# Altium schematic sheet KS-WL-GW-RS485.SchDoc
size A4; CheckedBy: Fan mingjie; DrawnBy: Jason Huang; Address1: Buliding 5, No.1528; Address2: Gu Mei Rd HQ6; Address3: Shanghai, China; Address4: 20233; DocumentNumber: 1; Revision: 1; SheetNumber: 1; SheetTotal: 2
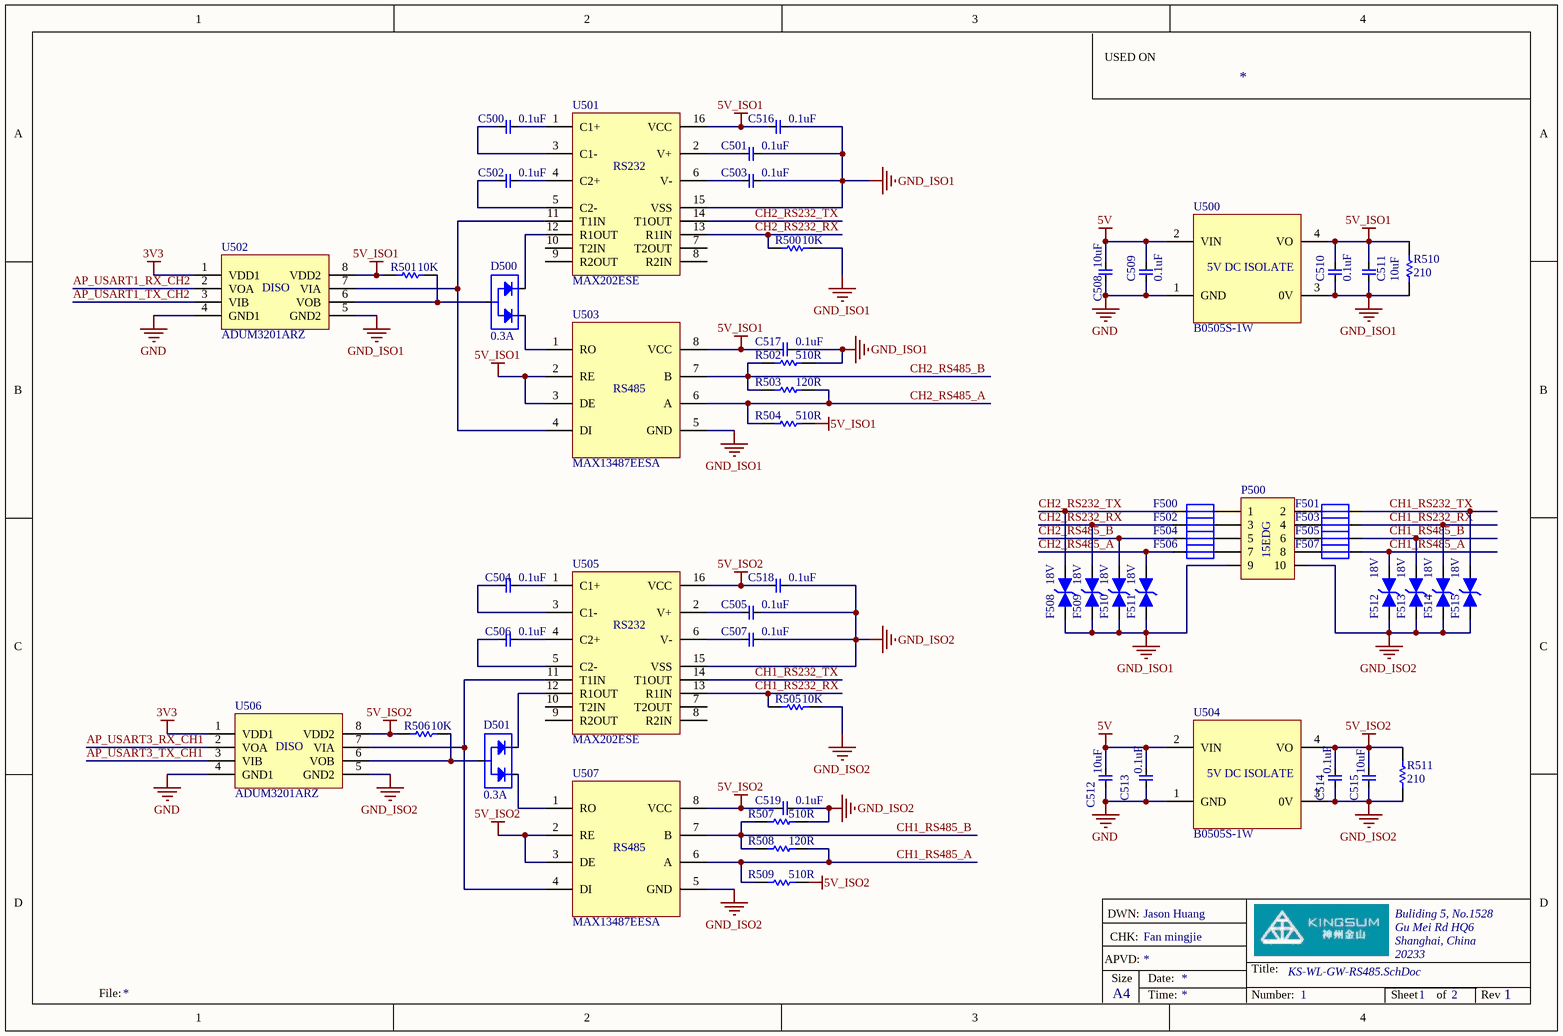
[diagram p0: KS-WL-GW-RS485.SchDoc]

## Parts
C500  0.1uF  [0402 CAP]
C501  0.1uF  [0402 CAP]
C502  0.1uF  [0402 CAP]
C503  0.1uF  [0402 CAP]
C504  0.1uF  [0402 CAP]
C505  0.1uF  [0402 CAP]
C506  0.1uF  [0402 CAP]
C507  0.1uF  [0402 CAP]
C508  10uF  [C1206_L]
C509  0.1uF  [0402 CAP]
C510  0.1uF  [0402 CAP]
C511  10uF  [C1206_L]
C512  10uF  [C1206_L]
C513  0.1uF  [0402 CAP]
C514  0.1uF  [0402 CAP]
C515  10uF  [C1206_L]
C516  0.1uF  [0402 CAP]
C517  0.1uF  [0402 CAP]
C518  0.1uF  [0402 CAP]
C519  0.1uF  [0402 CAP]
D500  0.3A  [SOT-23-3]
D501  0.3A  [SOT-23-3]
F500  1206L025YR  [1206_FUSE]  (value not drawn)
F501  1206L025YR  [1206_FUSE]  (value not drawn)
F502  1206L025YR  [1206_FUSE]  (value not drawn)
F503  1206L025YR  [1206_FUSE]  (value not drawn)
F504  1206L025YR  [1206_FUSE]  (value not drawn)
F505  1206L025YR  [1206_FUSE]  (value not drawn)
F506  1206L025YR  [1206_FUSE]  (value not drawn)
F507  1206L025YR  [1206_FUSE]  (value not drawn)
F508  18V  [LC-SMB(DO-214AA)_S5]
F509  18V  [LC-SMB(DO-214AA)_S5]
F510  18V  [LC-SMB(DO-214AA)_S5]
F511  18V  [LC-SMB(DO-214AA)_S5]
F512  18V  [LC-SMB(DO-214AA)_S5]
F513  18V  [LC-SMB(DO-214AA)_S5]
F514  18V  [LC-SMB(DO-214AA)_S5]
F515  18V  [LC-SMB(DO-214AA)_S5]
P500  Kingsum-CONN-15EDG 5X2  [15EDG-5x2 LOCK]  (value not drawn)
R500  10K  [0402 Res]
R501  10K  [0402 Res]
R502  510R  [0402 Res]
R503  120R  [0402 Res]
R504  510R  [0402 Res]
R505  10K  [0402 Res]
R506  10K  [0402 Res]
R507  510R  [0402 Res]
R508  120R  [0402 Res]
R509  510R  [0402 Res]
R510  210  [0805 Res]
R511  210  [0805 Res]
U500  B0505S-1W  [B0505S]
U501  MAX202ESE  [SOIC-16]
U502  ADUM3201ARZ  [SOIC-SN8_M]
U503  MAX13487EESA  [SOIC-SN8_M]
U504  B0505S-1W  [B0505S]
U505  MAX202ESE  [SOIC-16]
U506  ADUM3201ARZ  [SOIC-SN8_M]
U507  MAX13487EESA  [SOIC-SN8_M]

## Nets
3V3: U502.1(VDD1) U506.1(VDD1)
5V: C508.2 C509.2 C512.2 C513.2 U500.2(VIN) U504.2(VIN)
5V_ISO1: C510.2 C511.2 C516.1 C517.1 R501.1 R504.1 R510.2 U500.4(VO) U501.16(VCC) U502.8(VDD2) U503.2(RE) U503.3(DE) U503.8(VCC)
5V_ISO2: C514.2 C515.2 C518.1 C519.1 R506.1 R509.1 R511.2 U504.4(VO) U505.16(VCC) U506.8(VDD2) U507.2(RE) U507.3(DE) U507.8(VCC)
GND: C508.1 C509.1 C512.1 C513.1 U500.1(GND) U502.4(GND1) U504.1(GND) U506.4(GND1)
GND_ISO1: C501.2 C503.2 C510.1 C511.1 C516.2 C517.2 F508.1 F509.1 F510.1 F511.1 P500.9 R500.2 R502.1 R510.1 U500.3(0V) U501.15(VSS) U502.5(GND2) U503.5(GND)
GND_ISO2: C505.2 C507.2 C514.1 C515.1 C518.2 C519.2 F512.1 F513.1 F514.1 F515.1 P500.10 R505.2 R507.1 R511.1 U504.3(0V) U505.15(VSS) U506.5(GND2) U507.5(GND)
AP_USART1_RX_CH2: U502.2(VOA)
AP_USART1_TX_CH2: U502.3(VIB)
AP_USART3_RX_CH1: U506.2(VOA)
AP_USART3_TX_CH1: U506.3(VIB)
CH1_RS232_RX: F503.2 F514.2 R505.1 U505.13(R1IN)
CH1_RS232_TX: F501.2 F515.2 U505.14(T1OUT)
CH1_RS485_A: F507.2 F512.2 R508.2 R509.2 U507.6(A)
CH1_RS485_B: F505.2 F513.2 R507.2 R508.1 U507.7(B)
CH2_RS232_RX: F502.1 F509.2 R500.1 U501.13(R1IN)
CH2_RS232_TX: F500.1 F508.2 U501.14(T1OUT)
CH2_RS485_A: F506.1 F511.2 R503.2 R504.2 U503.6(A)
CH2_RS485_B: F504.1 F510.2 R502.2 R503.1 U503.7(B)
NetC500_1: C500.1 U501.3(C1-)
NetC500_2: C500.2 U501.1(C1+)
NetC501_1: C501.1 U501.2(V+)
NetC502_1: C502.1 U501.5(C2-)
NetC502_2: C502.2 U501.4(C2+)
NetC503_1: C503.1 U501.6(V-)
NetC504_1: C504.1 U505.3(C1-)
NetC504_2: C504.2 U505.1(C1+)
NetC505_1: C505.1 U505.2(V+)
NetC506_1: C506.1 U505.5(C2-)
NetC506_2: C506.2 U505.4(C2+)
NetC507_1: C507.1 U505.6(V-)
NetD500_1: D500.1 U503.1(RO)
NetD500_2: D500.2 U501.12(R1OUT)
NetD500_3: D500.3 R501.2 U502.6(VOB)
NetD501_1: D501.1 U507.1(RO)
NetD501_2: D501.2 U505.12(R1OUT)
NetD501_3: D501.3 R506.2 U506.6(VOB)
NetF500_2: F500.2 P500.1
NetF501_1: F501.1 P500.2
NetF502_2: F502.2 P500.3
NetF503_1: F503.1 P500.4
NetF504_2: F504.2 P500.5
NetF505_1: F505.1 P500.6
NetF506_2: F506.2 P500.7
NetF507_1: F507.1 P500.8
NetU501_11: U501.11(T1IN) U502.7(VIA) U503.4(DI)
NetU505_11: U505.11(T1IN) U506.7(VIA) U507.4(DI)

Not connected (* = marked no-connect by the designer): U501 7(T2OUT) 8(R2IN) 9(R2OUT) 10(T2IN); U505 7(T2OUT) 8(R2IN) 9(R2OUT) 10(T2IN)

## Notes on the sheet
- USED ON
- DWN:
- APVD:
- CHK:
- Size
- Date:
- Title:
- File:
- A4
- Time:
- Number:
- Sheet
- of
- Rev
- (in symbol Kingsum-CONN-15EDG 5X2) 15EDG
- (in symbol Kingsum-DCDC-B0505S-1W) 5V DC ISOLATE
- (in symbol Kingsum-OPT-ADUM3201ARZ) DISO
- (in symbol Kingsum-RS232-MAX202ESE) RS232
- (in symbol Kingsum-RS485-MAX13487EESA) RS485

## Library data of the parts
C500-C507 C516-C519 = ADE-C0402-0.1U: Non-polarised capacitor; Part Rev: V; Part Description: CAPACITOR, CERAMIC CHIP, 0402 CASE, SURFACE MOUNT , 0.1 uF +/-20% 25 V, X7R; Mfr_PN: GRM155R61E104KA87; Manufacturer: MURATA; Tolerance: +/-10%; Volt-Rated: 25 V; Signal Integrity: Cap; Option: 0; TE PN: ADE-C0402-0.1U; Series: MLCC; RoHS Compliant: YES; Value: 0.1uF; Package: 0402; Footprint: 0402; SPICE model: CAP; Published: 10/14/2016; Publisher: TE Connectivity; LatestRevisionDate: 04/22/2013; LatestRevisionNote: Production; ComponentLink1Description: Datasheet; ComponentLink1URL: http://engineeringportal.tycoelectronics.com/web/engineering/part-inquiry?PartNo=1-20065-7; ComponentLink3Description: Package; ComponentLink3URL: http://www.murata.com/products/catalog/pdf/c02e.pdf; ComponentLink2Description: Web Page; ComponentLink2URL: http://dmtec.tycoelectronics.com/dmtec/servlet/DocumentLookup?type=Production+Drawing&name=20065&format=PDF; Manufacturer2: Yageo; Mfr_PN2: CC0402KRX7R8BB104
C508 C511 C512 C515 = ADE-C1206-10U: Non-polarised capacitor; Part Rev: V; Part Description: CAPACITOR, CERAMIC CHIP, 1206 CASE, SURFACE MOUNT , 10uF +/-20% 25V, X5R; Manufacturer: MURATA; Tolerance: +/-20%; Volt-Rated: 25V; Signal Integrity: Cap; Designator: GRM31CR61E106KE15; Option: 0; TE PN: ADE-C1206-10U; Series: MLCC; RoHS Compliant: YES; Value: 10uF; Package: C1206_L; Footprint: C1206; SPICE model: CAP; Published: 10/17/2016; Publisher: TE Connectivity; LatestRevisionDate: 08/05/2013; LatestRevisionNote: Production; ComponentLink1Description: Datasheet; ComponentLink1URL: http://www.murata.com/products/catalog/pdf/c02e.pdf; Mfr_PN: GRM31CR61E106KE15; ComponentLink3Description: Package; ComponentLink2Description: Web Page
C509 C510 C513 C514 = ADE-C0402-0.1U: Non-polarised capacitor; Part Rev: V; Part Description: CAPACITOR, CERAMIC CHIP, 0402 CASE, SURFACE MOUNT , 0.1 uF +/-20% 25 V, X7R; Manufacturer: MURATA; Tolerance: +/-10%; Volt-Rated: 25 V; Signal Integrity: Cap; Designator: GRM155R61E104KA87; Option: 0; TE PN: ADE-C0402-0.1U; Series: MLCC; RoHS Compliant: YES; Value: 0.1uF; Package: 0402; Footprint: 0402; SPICE model: CAP; Published: 10/14/2016; Publisher: TE Connectivity; LatestRevisionDate: 04/22/2013; LatestRevisionNote: Production; ComponentLink1Description: Datasheet; ComponentLink1URL: http://engineeringportal.tycoelectronics.com/web/engineering/part-inquiry?PartNo=1-20065-7; Mfr_PN: GRM155R61E104KA87; ComponentLink3Description: Package; ComponentLink3URL: http://www.murata.com/products/catalog/pdf/c02e.pdf; ComponentLink2Description: Web Page; ComponentLink2URL: http://dmtec.tycoelectronics.com/dmtec/servlet/DocumentLookup?type=Production+Drawing&name=20065&format=PDF; Manufacturer2: Yageo; Mfr_PN2: CC0402KRX7R8BB104
D500 D501 = Kingsum-DIODES-BAT54A: TO-236, 30V,200mA, Comm A; Mfr_PN: BAT54A; Manufacturer: JCST; Power-Rated: 255mW; Option: 0; Tmp Range: -50 to 150; Kingsum_PN: Kingsum-DIODES-BAT54A; Part Rev: A; Series: Diode; Part Description: TO-236, 30V,200mA, Comm A; ComponentLink3URL: http://www.szlcsc.com/product/details_9086.html; RoHS Compliant: YES; Value: 0.3A; Package: SOT-23-3; Volt-Rated: 30 V; SPICE model: Diode; Published: 24/02/2014; Publisher: TE Connectivity; LatestRevisionDate: 27/02/2013; LatestRevisionNote: Production; ComponentLink3Description: Procurement; Price: 0.1
F500-F507 = Kingsum-FUSE-1206L025YR: 1206 Fuse 0.25A ,16V; Part Rev: A; Manufacturer: Littelfuse; Value: 0.25; Signal Integrity: Res; Option: 0; Tmp Range: -40 to 85; Kingsum_PN: Kingsum-FUSE-1206L025YR; ComponentLink2Description: Web Page; Series: FUSE; Part Description: 1206 Fuse 0.25A; Mfr_PN: 1206L025YR; ComponentLink3URL: http://www.szlcsc.com/product/details_100777.html; RoHS Compliant: YES; Package: 1206 FUSE; Volt-Rated: 16V; Footprint: 1206 FUSE; SPICE model: RESISTOR; Published: 07/05/2013; Publisher: TE Connectivity; LatestRevisionDate: 11/15/2012; LatestRevisionNote: Production; ComponentLink1Description: Datasheet; ComponentLink3Description: Procurement
F508-F515 = Kingsum-TVS-SMBJ18CA: SMB, 18V, 600W, Bidirectional; Part Rev: A; Manufacturer: Littelfuse; Signal Integrity: Res; Option: 0; Tmp Range: -40 to 85; Kingsum_PN: Kingsum-TVS-SMBJ18CA; ComponentLink2Description: Web Page; Series: FUSE; Part Description: SMB, 18V, 600W, Bidirectional; Mfr_PN: SMBJ18CA; ComponentLink3URL: http://www.szlcsc.com/product/details_115230.html; RoHS Compliant: YES; Value: 600W; Package: SMB; Volt-Rated: 18V; Footprint: SMB; SPICE model: RESISTOR; Published: 07/05/2013; Publisher: TE Connectivity; LatestRevisionDate: 11/15/2012; LatestRevisionNote: Production; ComponentLink1Description: Datasheet; ComponentLink3Description: Procurement
P500 = Kingsum-CONN-15EDG 5X2: Header, 10pin, 5x2; Manufacturer: 奥斯电子有限公司; Mfr_PN: 15EDGKDM-3.81-5P Set; Part Description: Header 15EDG Right angle 3.81mm 2X5P; Option: 0; LatestRevisionDate: 17-Jul-2002; LatestRevisionNote: Re-released for DXP Platform.; Publisher: Belle 13600268167; ComponentLink2Description: Web Page; ComponentLink1Description: Datasheet; ComponentLink3Description: Package; Price: 9.72; Footprint: HDR2X12
R500 R501 R505 R506 = ADE-R0402-10K: RESISTOR  Normal; Part Rev: A; Part Description: RESISTOR, CHIP, THICK FILM, SURGE CURRENT, 0402 CASE, 1/16 W, 50 V , 10K OHMS +/-5%, +/-100 PPM/DEG C, TIN TERMINATION; Mfr_PN: RC0402JR-7D10KL; Manufacturer: YAGEO; Precision: +/-5%; Volt-Rated: 50 V; Power-Rated: 1/16 W; Signal Integrity: Res; Option: 0; TE_PN: ADE-R0402-10K; ComponentLink2Description: Web Page; ComponentLink2URL: http://dmtec.tycoelectronics.com/dmtec/servlet/DocumentLookup?type=Production+Drawing&name=1900457&format=PDF; Series: General Purpose Chip Resistors; ComponentLink3URL: http://www.yageo.com/documents/recent/PYu-RC0402_51_RoHS_L_6_r.pdf; RoHS Compliant: YES; Value: 10K; Package: 0402; Footprint: kOA1E-0402; SPICE model: RESISTOR; Published: 25/04/2013; Publisher: TE Connectivity; LatestRevisionDate: 25/04/2013; LatestRevisionNote: Production; ComponentLink1URL: http://engineeringportal.tycoelectronics.com/web/engineering/part-inquiry?PartNo=1900457-1; ComponentLink1Description: Datasheet; ComponentLink3Description: Package
R502 R504 R507 R509 = ADE-R0402-510R: RES, Carbon Film SMT0402, 510 Ohm, 5%, 1/16W; Part Rev: A; Mfr_PN: RC0402JR-7D510RL; Manufacturer: YAGEO; Precision: +/-5%; Volt-Rated: 50 V; Option: 0; TE_PN: ADE-R0402-510R; ComponentLink2Description: Web Page; ComponentLink2URL: http://dmtec.tycoelectronics.com/dmtec/servlet/DocumentLookup?type=Production+Drawing&name=1900457&format=PDF; Series: General Purpose Chip Resistors; Part Description: RES, Carbon Film SMT0402, 510 Ohm, 5%, 1/16W; ComponentLink3URL: http://www.yageo.com/documents/recent/PYu-RC0402_51_RoHS_L_6_r.pdf; RoHS Compliant: YES; Value: 510R; Package: 0402; Power-Rated: 1/16 W; Footprint: 0402; SPICE model: RESISTOR; Signal Integrity: Res; Published: 25/04/2013; Publisher: TE Connectivity; LatestRevisionDate: 25/04/2013; LatestRevisionNote: Production; ComponentLink1URL: http://engineeringportal.tycoelectronics.com/web/engineering/part-inquiry?PartNo=1900457-1; ComponentLink1Description: Datasheet; ComponentLink3Description: Package
R503 R508 = ADE-R0402-120R: RESISTOR  Normal; Part Rev: A; Part Description: RESISTOR, CHIP, THICK FILM, SURGE CURRENT, 0402 CASE, 1/16 W, 50 V , 150R OHMS +/-5%, +/-100 PPM/DEG C, TIN TERMINATION; Mfr_PN: RC0402JR-7D120RL; Manufacturer: YAGEO; Precision: +/-5%; Volt-Rated: 50 V; Power-Rated: 1/16 W; Signal Integrity: Res; Option: 0; TE_PN: ADE-R0402-120R; ComponentLink2Description: Web Page; ComponentLink2URL: http://dmtec.tycoelectronics.com/dmtec/servlet/DocumentLookup?type=Production+Drawing&name=1900457&format=PDF; Series: General Purpose Chip Resistors; ComponentLink3URL: http://www.yageo.com/documents/recent/PYu-RC0402_51_RoHS_L_6_r.pdf; RoHS Compliant: YES; Value: 120R; Package: 0402; Footprint: kOA1E-0402; SPICE model: RESISTOR; Published: 25/04/2013; Publisher: TE Connectivity; LatestRevisionDate: 25/04/2013; LatestRevisionNote: Production; ComponentLink1URL: http://engineeringportal.tycoelectronics.com/web/engineering/part-inquiry?PartNo=1900457-1; ComponentLink1Description: Datasheet; ComponentLink3Description: Package
R510 R511 = ADE-R0805-210R: RESISTOR  Normal; Part Rev: A; Part Description: RESISTOR, CHIP, THICK FILM, SURGE CURRENT, 0805 CASE, 1/8 W, 150V, 1 A , 210 OHMS +/-5%, +/-200 PPM/DEG C, TIN TERMINATION; Mfr_PN: RC0805JR-7D210RL; Manufacturer: YAGEO; Precision: +/-5%; Volt-Rated: 150 V; Power-Rated: 1/8 W; Signal Integrity: Res; Option: 0; TE_PN: ADE-R0805-210R; ComponentLink2Description: Web Page; ComponentLink2URL: http://dmtec.tycoelectronics.com/dmtec/servlet/DocumentLookup?type=Production+Drawing&name=1900457&format=PDF; Series: General Purpose Chip Resistors; ComponentLink3URL: http://www.yageo.com/documents/recent/PYu-RC0402_51_RoHS_L_6_r.pdf; RoHS Compliant: YES; Value: 210; Package: 0805; Footprint: kOA2A-0805; SPICE model: RESISTOR; Designator: RC0805JR-7D210RL; Published: 25/04/2013; Publisher: TE Connectivity; LatestRevisionDate: 11/15/2012; LatestRevisionNote: Production; ComponentLink1Description: Datasheet; ComponentLink3Description: Package
U500 U504 = Kingsum-DCDC-B0505S-1W: DC/DC module 5Vin 5Vout, 1W, 1000V; Manufacturer: MORNSUN; Option: 0; Publisher: FMJ; ComponentLink1Description: Datasheet; ComponentLink1URL: Datasheet/DCDC; ComponentLink2Description: Web Page; ComponentLink3Description: Procurement; ComponentLink3URL: https://item.taobao.com/item.htm?spm=a1z10.3-c.w4002-15231643157.18.6e5dfb10cHAq7M&id=14277528359; Code_IPC: *; Code_JEITA: *; LatestRevisionNote: PRODUCTION; Mfr_PN: B0505S-1W; Package: B0505S; Part Rev: *; Published: 10/14/2016; RoHS Compliant: YES; Kingsum PN: Kingsum-DCDC-B0505S-1W; Part Description: DC/DC module 5Vin 5Vout, 1W, 1000V; Price: 8.38; Stock: *; Stock Position: *
U501 U505 = Kingsum-RS232-MAX202ESE: 5V, RS-232 Transceivers with 0.1μF External Capacitors; Manufacturer: MAXIM; Option: 0; Tmp Range: -40 to 85; Publisher: FMJ; ComponentLink1Description: Datasheet; ComponentLink1URL: Datasheet/RS232; ComponentLink2Description: Web Page; ComponentLink3Description: Procurement; ComponentLink3URL: http://www.szlcsc.com/product/details_10482.html; Code_IPC: *; Code_JEITA: *; Footprint: SO16; LatestRevisionNote: PRODUCTION; Mfr_PN: MAX202ESE; Package: SO16; Part Rev: *; Published: 10/14/2016; RoHS Compliant: YES; Kingsum PN: Kingsum-RS232-MAX202ESE; Part Description: 5V, RS-232 Transceivers with 0.1μF External Capacitors; Price: 6; Stock: *; Stock Position: *
U502 U506 = Kingsum-OPT-ADUM3201ARZ: Dual-Channel, Digital Isolators,  Enhanced System-Level ESD Reliability; Manufacturer: RICHTEK; Option: 0; Tmp Range: -40 to 105; Publisher: FMJ; ComponentLink1Description: Datasheet; ComponentLink1URL: Datasheet/OPT; ComponentLink2Description: Web Page; ComponentLink3Description: Package; Code_IPC: *; Code_JEITA: *; Footprint: SOIC8; LatestRevisionNote: PRODUCTION; Mfr_PN: ADUM3201ARZ; Package: SOIC8; Part Rev: *; Published: 10/14/2016; RoHS Compliant: YES; Kingsum PN: Kingsum-OPT-ADUM3201ARZ; Part Description: Dual-Channel, Digital Isolators,  Enhanced System-Level ESD Reliability; Price: 4; Stock: *; Stock Position: *
U503 U507 = Kingsum-RS485-MAX13487EESA: Half-Duplex RS-485-/RS-422-Compatible; Manufacturer: MAXIM; Option: 0; Tmp Range: -40 to 85; Publisher: FMJ; ComponentLink1Description: Datasheet; ComponentLink1URL: Datasheet/RS485; ComponentLink2Description: Web Page; ComponentLink3Description: Procurement; ComponentLink3URL: http://www.szlcsc.com/product/details_19043.html; Code_IPC: *; Code_JEITA: *; Footprint: SO8; LatestRevisionNote: PRODUCTION; Mfr_PN: MAX13487EESA; Package: SO8; Part Rev: *; Published: 10/14/2016; RoHS Compliant: YES; Kingsum PN: Kingsum-RS485-MAX13487EESA; Part Description: Half-Duplex RS-485-/RS-422-Compatible; Price: 4.4; Stock: *; Stock Position: *